# Altium schematic sheet MainBoard_AD9835.SchDoc
size A
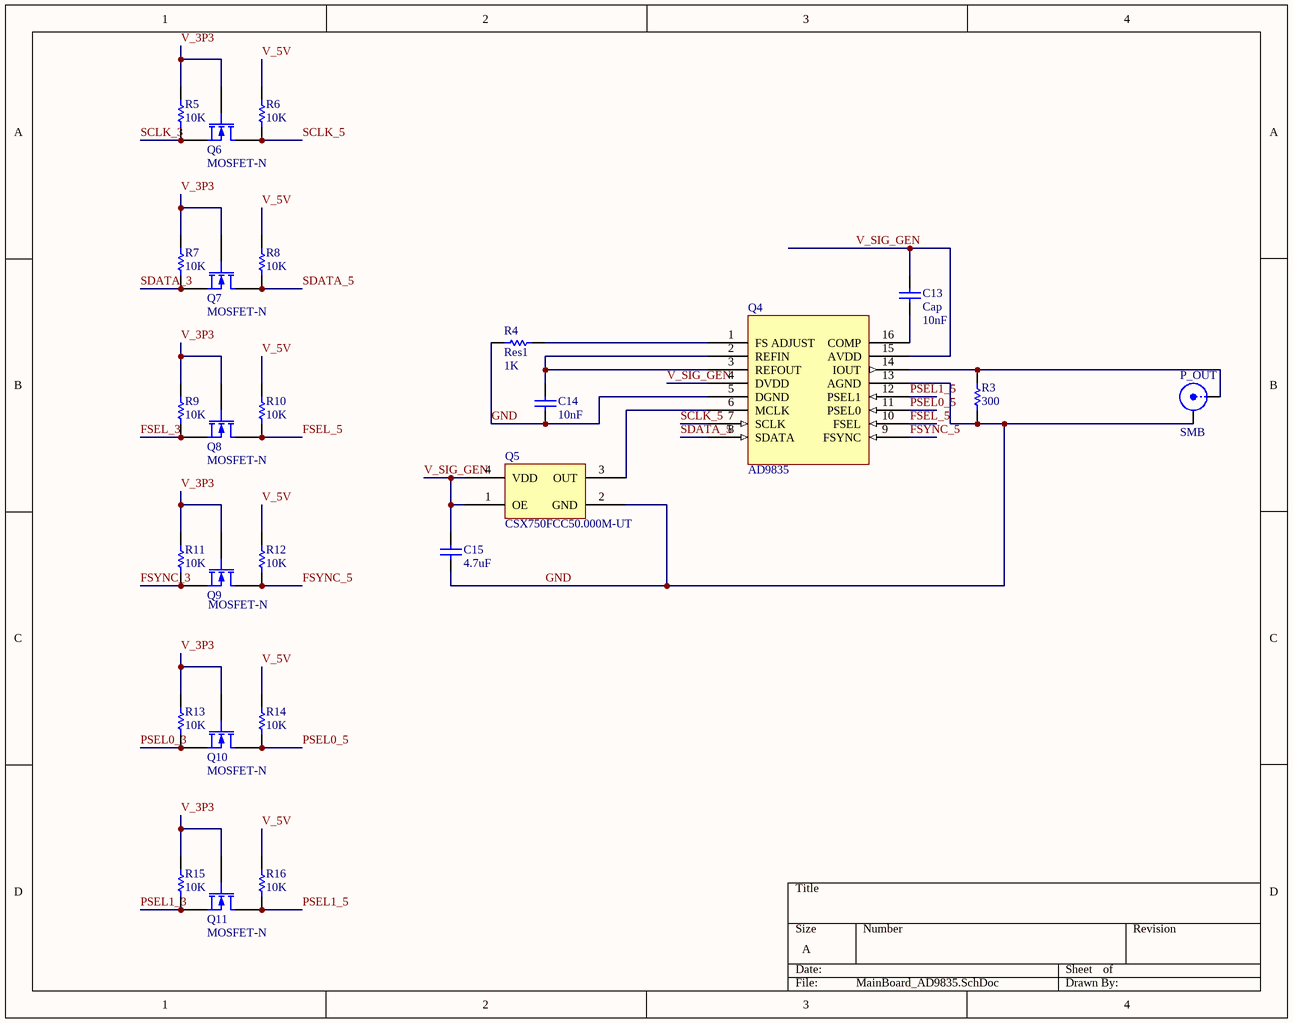
[diagram p0: MainBoard_AD9835.SchDoc]

## Parts
C13  Cap  value 10nF  [CAPR2.54-5.1x3.2]
C14  value 10nF  [CAPR2.54-5.1x3.2]  (hidden comment: Cap)
C15  value 4.7uF  [CAPR2.54-5.1x3.2]  (hidden comment: Cap)
P_OUT  SMB  [SMB_V-RJ45]
Q4  AD9835  [TSSOP16]
Q5  CSX750FCC50.000M-UT  [CSX750]
Q6  MOSFET-N  [BCY-W3/B.8]
Q7  MOSFET-N  [BCY-W3/B.8]
Q8  MOSFET-N  [BCY-W3/B.8]
Q9  MOSFET-N  [BCY-W3/B.8]
Q10  MOSFET-N  [BCY-W3/B.8]
Q11  MOSFET-N  [BCY-W3/B.8]
R3  value 300  [AXIAL-0.3]  (hidden comment: Res1)
R4  Res1  value 1K  [AXIAL-0.3]
R5  value 10K  [AXIAL-0.3]  (hidden comment: Res1)
R6  value 10K  [AXIAL-0.3]  (hidden comment: Res1)
R7  value 10K  [AXIAL-0.3]  (hidden comment: Res1)
R8  value 10K  [AXIAL-0.3]  (hidden comment: Res1)
R9  value 10K  [AXIAL-0.3]  (hidden comment: Res1)
R10  value 10K  [AXIAL-0.3]  (hidden comment: Res1)
R11  value 10K  [AXIAL-0.3]  (hidden comment: Res1)
R12  value 10K  [AXIAL-0.3]  (hidden comment: Res1)
R13  value 10K  [AXIAL-0.3]  (hidden comment: Res1)
R14  value 10K  [AXIAL-0.3]  (hidden comment: Res1)
R15  value 10K  [AXIAL-0.3]  (hidden comment: Res1)
R16  value 10K  [AXIAL-0.3]  (hidden comment: Res1)

## Nets
FSEL_3: Q8.3(S) R9.1
FSEL_5: Q4.10(FSEL) Q8.1(D) R10.1
FSYNC_3: Q9.3(S) R11.1
FSYNC_5: Q4.9(FSYNC) Q9.1(D) R12.1
GND: C14.1 C15.1 P_OUT.2(Y) Q4.5(DGND) Q4.13(AGND) Q5.2(GND) R3.1 R4.1
PSEL0_3: Q10.3(S) R13.1
PSEL0_5: Q4.11(PSEL0) Q10.1(D) R14.1
PSEL1_3: Q11.3(S) R15.1
PSEL1_5: Q4.12(PSEL1) Q11.1(D) R16.1
SCLK_3: Q6.3(S) R5.1
SCLK_5: Q4.7(SCLK) Q6.1(D) R6.1
SDATA_3: Q7.3(S) R7.1
SDATA_5: Q4.8(SDATA) Q7.1(D) R8.1
V_3P3: Q6.2(G) Q7.2(G) Q8.2(G) Q9.2(G) Q10.2(G) Q11.2(G) R5.2 R7.2 R9.2 R11.2 R13.2 R15.2
V_5V: R6.2 R8.2 R10.2 R12.2 R14.2 R16.2
V_SIG_GEN: C13.2 C15.2 Q4.4(DVDD) Q4.15(AVDD) Q5.1(OE) Q5.4(VDD)
NetC13_1: C13.1 Q4.16(COMP)
NetC14_2: C14.2 Q4.2(REFIN) Q4.3(REFOUT)
NetP_OUT_1: P_OUT.1(X) Q4.14(IOUT) R3.2
NetQ4_1: Q4.1(FS_ADJUST) R4.2
NetQ4_6: Q4.6(MCLK) Q5.3(OUT)

## Library data of the parts
C13-C15 = Cap: Capacitor; Published: 8-Jun-2000; LatestRevisionDate: 17-Jul-2002; LatestRevisionNote: Re-released for DXP Platform.; PackageReference: RAD-0.3; Publisher: Altium Limited
P_OUT = SMB: SMB Straight Connector; LatestRevisionDate: 17-Jul-2002; LatestRevisionNote: Re-released for DXP Platform.; Publisher: Altium Limited
Q6-Q11 = MOSFET-N: N-Channel MOSFET; Published: 8-Jun-2000; LatestRevisionDate: 17-Jul-2002; LatestRevisionNote: Re-released for DXP Platform.; PackageVersion: 1995/1996; PackageReference: E3; Publisher: Altium Limited
R3-R16 = Res1: Resistor; Published: 8-Jun-2000; LatestRevisionDate: 17-Jul-2002; LatestRevisionNote: Re-released for DXP Platform.; PackageReference: AXIAL-0.3; Publisher: Altium Limited